# EAGLE design untitled (EAGLE 7.6.0)
TITLE: PSOC4 QFN
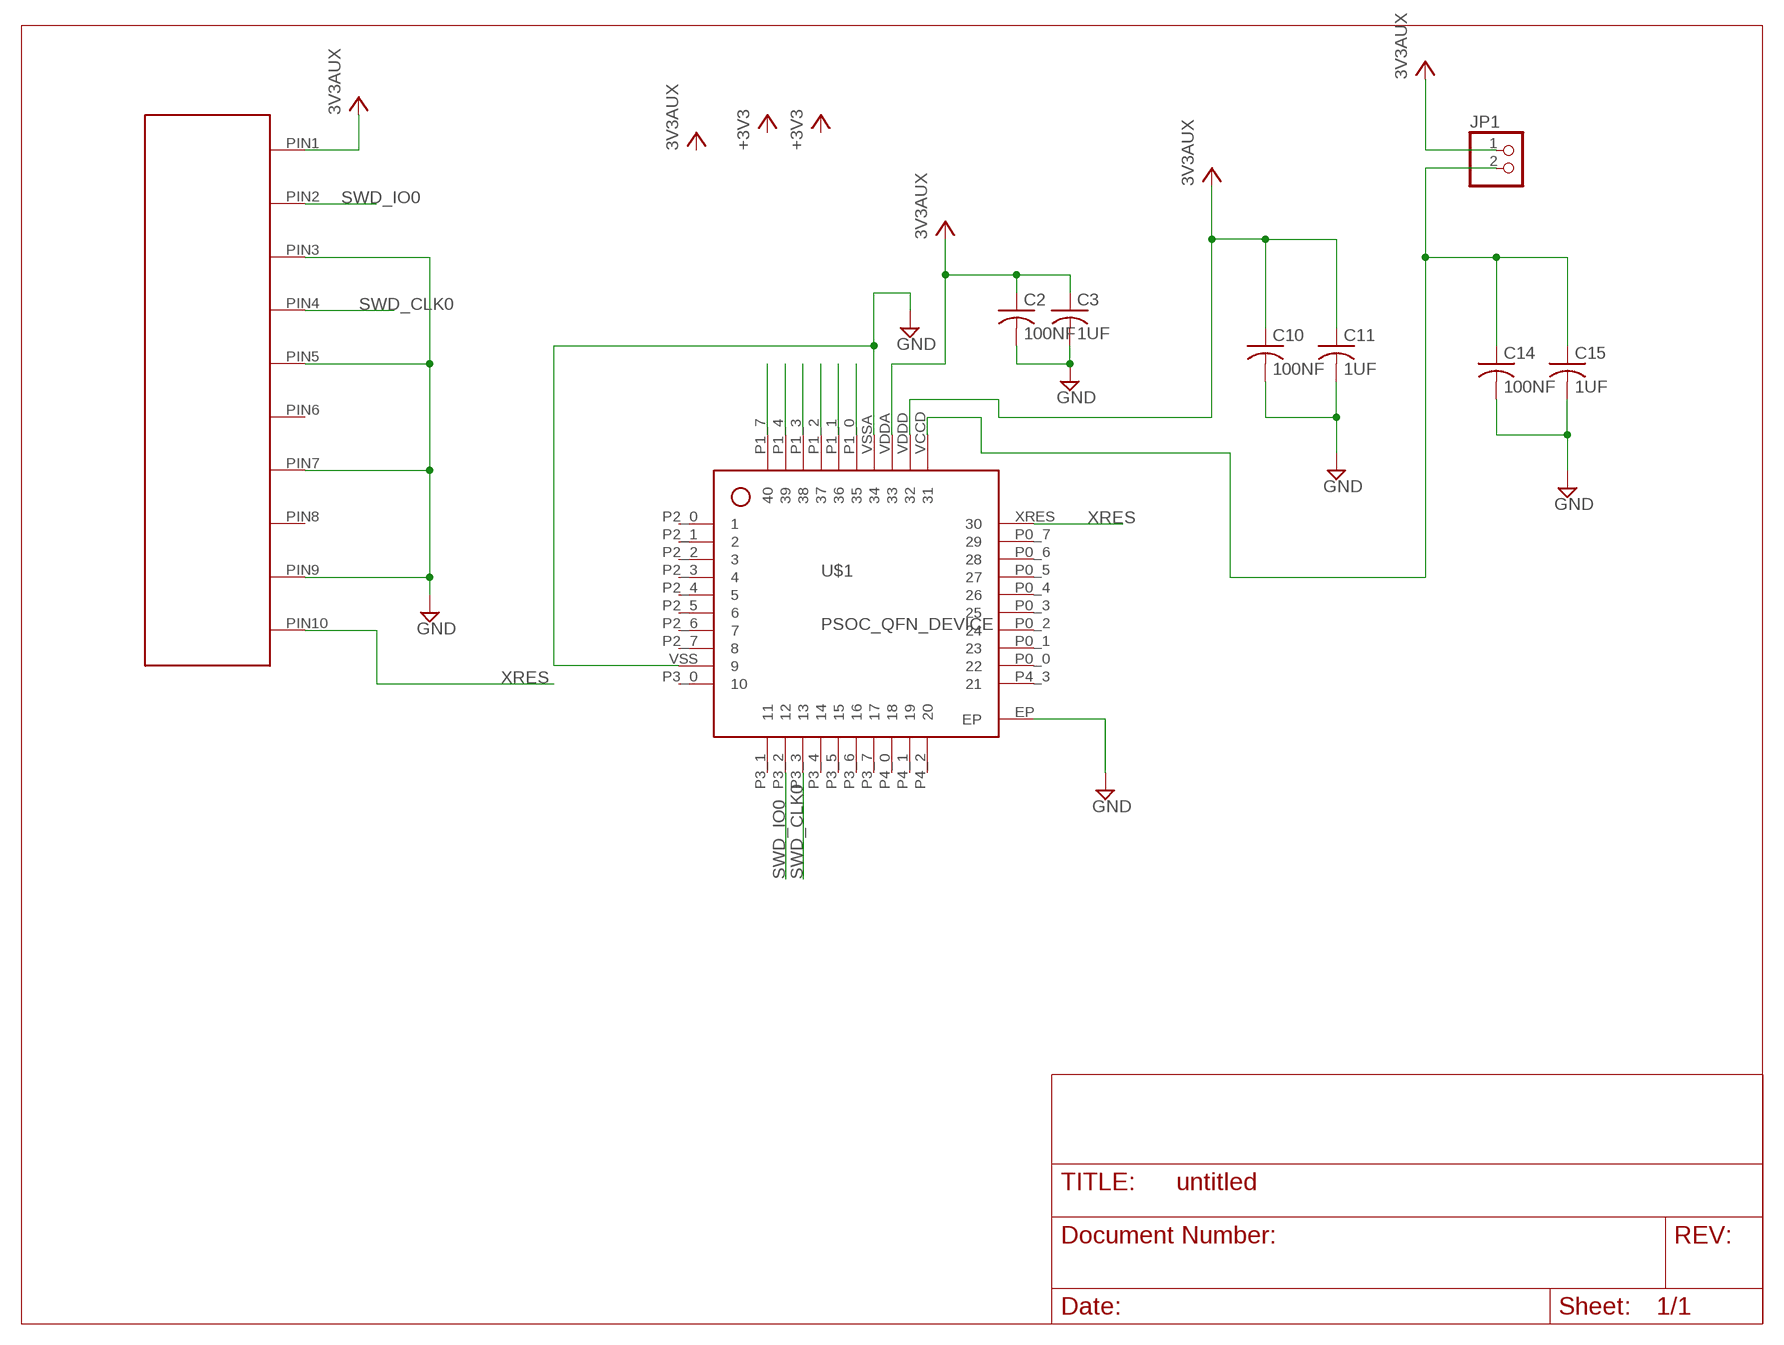
[diagram p0: schematic, sheet 1]
FRAME1 (LETTER_L): TITLE: PSOC

## Parts
C2  100NF  C-USC0603  [C0603]
C3  1UF  C-USC0603  [C0603]
C10  100NF  C-USC0603  [C0603]
C11  1UF  C-USC0603  [C0603]
C14  100NF  C-USC0603  [C0603]
C15  1UF  C-USC0603  [C0603]
JP1  PINHD-1X2/90  [1X02/90]
U$1  PSOC_QFN_DEVICE  [PSOC_QFN_PACKEGE]
U$2  PSOC_10_PIN_HEADER_DEVICE  [PSOC_10_PIN_HEADER]

## Nets
GND: C2.2 C3.2 C10.2 C11.2 C14.2 C15.2 U$1.EP U$1.VSS U$1.VSSA U$2.PIN3(GND) U$2.PIN5(GND) U$2.PIN7(GND) U$2.PIN9(GND)
N$1: U$1.P1_7
N$2: U$1.P1_4
N$3: U$1.P1_3
N$4: U$1.P1_2
N$5: U$1.P1_1
N$6: U$1.P1_0
SWD_CLK0: U$1.P3_3 U$2.PIN4(SWD_CLK0)
SWD_IO0: U$1.P3_2 U$2.PIN2(SWD_IO0)
VCC: C2.1 C3.1 C10.1 C11.1 JP1.1 U$1.VDDA U$1.VDDD U$2.PIN1(3V3_AUX) ; supply symbol labelled 3V3AUX
VCC2: C14.1 C15.1 JP1.2 U$1.VCCD
XRES: U$1.XRES U$2.PIN10(XRES)
Unconnected: U$1.P0_0 U$1.P0_1 U$1.P0_2 U$1.P0_3 U$1.P0_4 U$1.P0_5 U$1.P0_6 U$1.P0_7 U$1.P2_0 U$1.P2_1 U$1.P2_2 U$1.P2_3 U$1.P2_4 U$1.P2_5 U$1.P2_6 U$1.P2_7 U$1.P3_0 U$1.P3_1 U$1.P3_4 U$1.P3_5 U$1.P3_6 U$1.P3_7 U$1.P4_0 U$1.P4_1 U$1.P4_2 U$1.P4_3 U$2.PIN6(NC) U$2.PIN8(NC2)

## Library data of the parts
C2 C3 C10 C11 C14 C15 = rcl:C-US: CAPACITOR, American symbol
JP1 = pinhead:PINHD-1X2: PIN HEADER
U$1 = psoc_cy8c4245lqi-483:PSOC_QFN_DEVICE
U$2 = psoc_cy8c4245lqi-483:PSOC_10_PIN_HEADER_DEVICE

## Board
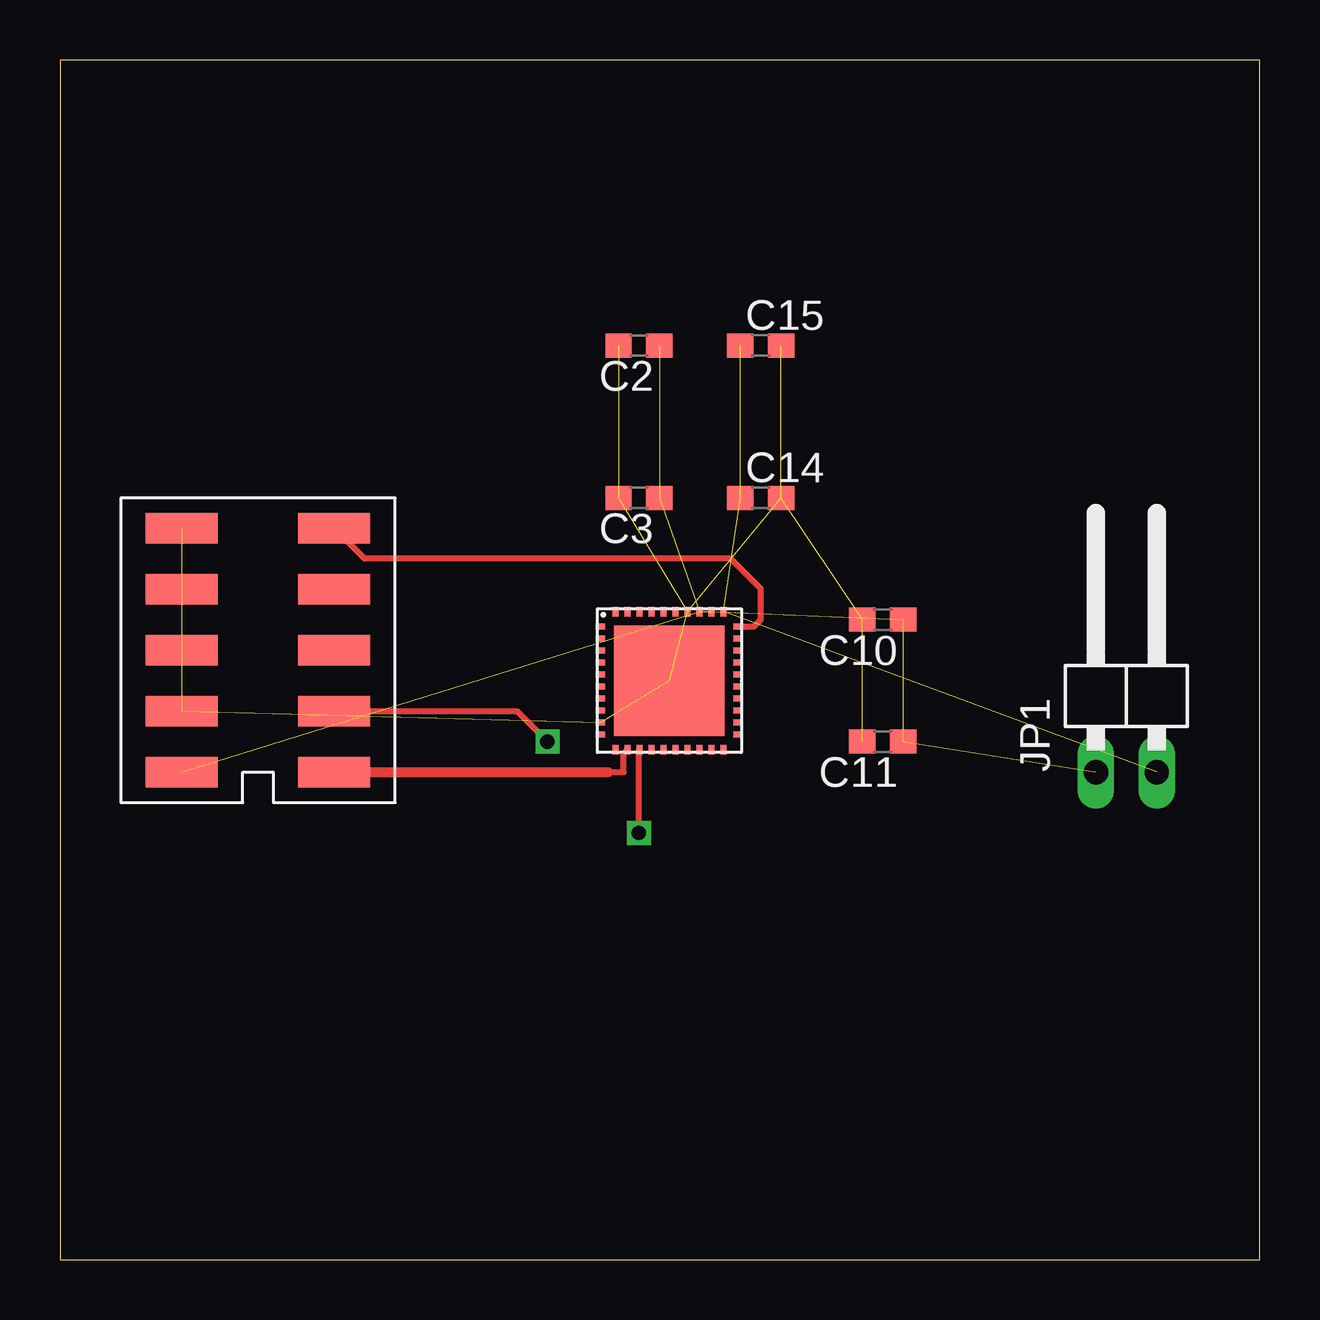
[diagram p1: board, top side]
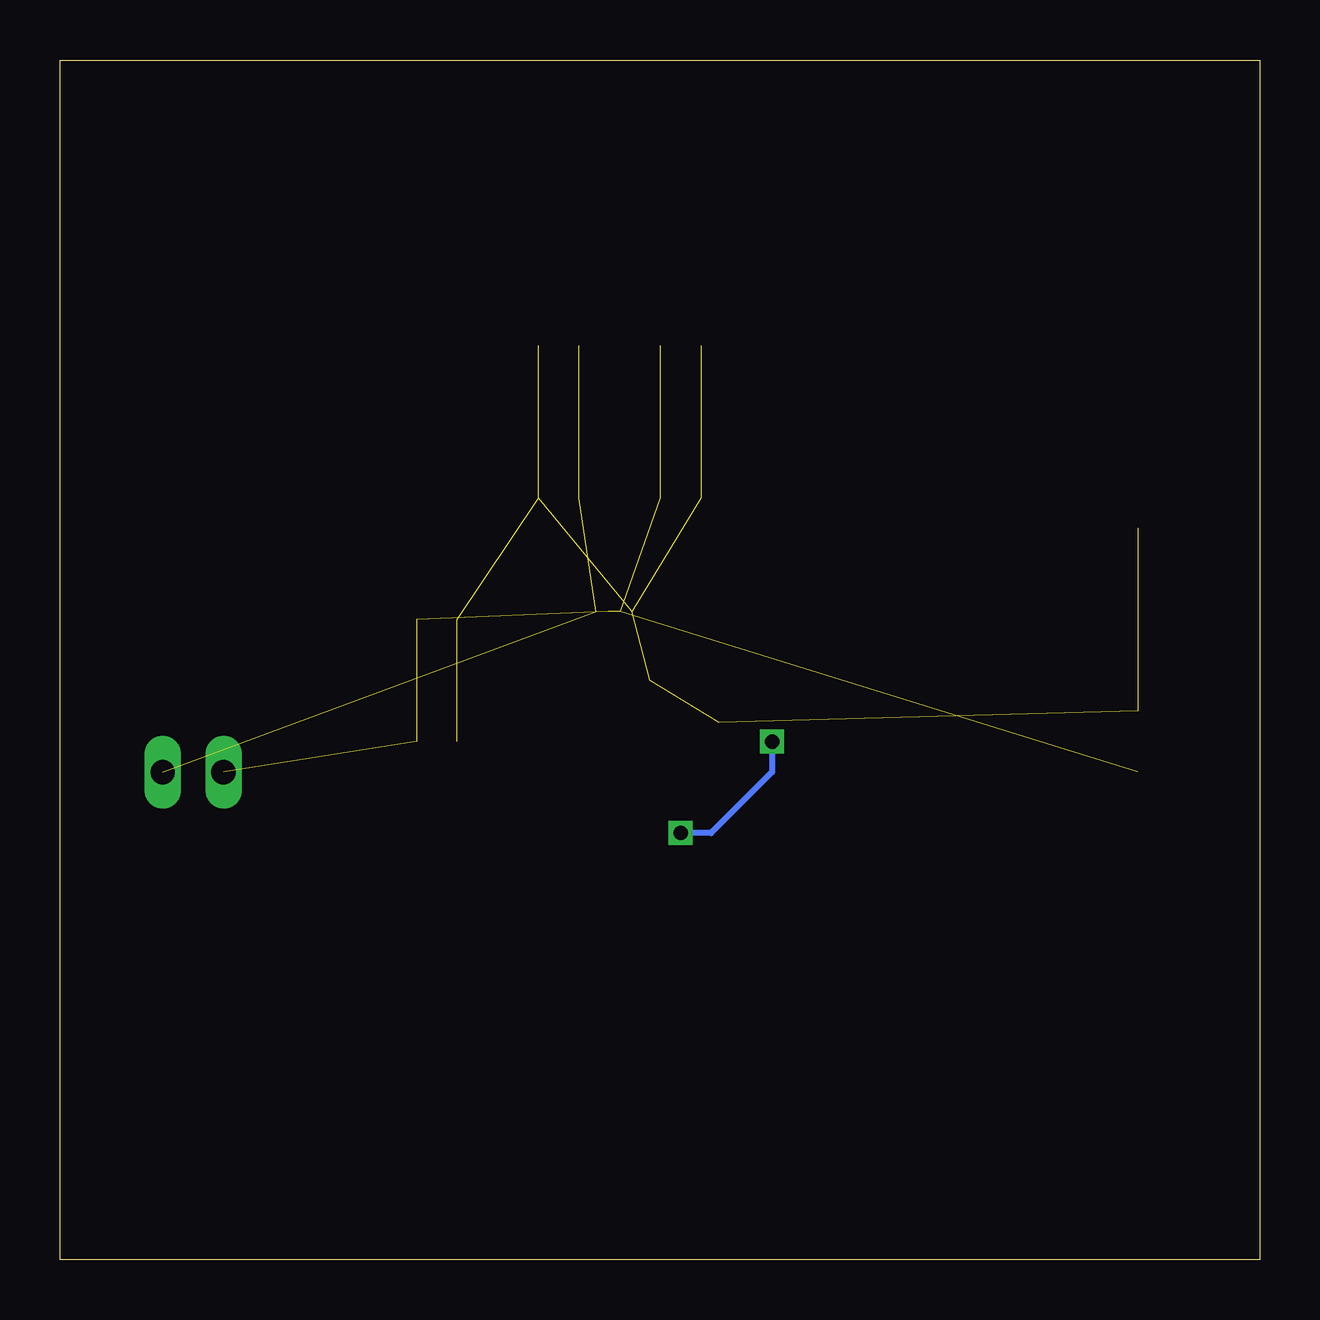
[diagram p2: board, bottom side, seen from below]

Size 50 x 50 mm. Coordinates in mm from the lower left corner, seen from the top.
Outline: 0,0 50,0 50,50 0,50 0,0
Copper layers (1*16): Top 0.035mm / dielectric 1.5mm / Bottom 0.035mm
Design rules "default": minimum track width 10mil, minimum drill 24mil, track to track 8mil, track to pad 8mil, pad to pad 8mil, via to via 8mil, smd to smd 8mil, copper to edge 40mil, drill to drill 8mil, minimum pad ring 10mil, minimum via ring 8mil, stop-mask expansion 4mil, vias tented up to drill 0mil, thermal gap 10mil

### Footprints (pad centres in the part's own frame; a part is rotated, then mirrored left to right if it is on the bottom)
C0603 = smd 1.1 x 1: 1 -0.85,0; 2 0.85,0
1X02/90 = drill 1.016 long: 1 -1.27,-3.81; 2 1.27,-3.81
PSOC_QFN_PACKEGE = smd 4.6 x 4.6: EP 0,0 | smd 0.4 x 0.25: P0_0 2.875,-1.75; P0_1 2.875,-1.25; P0_2 2.875,-0.75; P0_3 2.875,-0.25; P0_4 2.875,0.25; P0_5 2.875,0.75; P0_6 2.875,1.25; P0_7 2.875,1.75; P2_0 -2.875,2.25; P2_1 -2.875,1.75; P2_2 -2.875,1.25; P2_3 -2.875,0.75; P2_4 -2.875,0.25; P2_5 -2.875,-0.25; P2_6 -2.875,-0.75; P2_7 -2.875,-1.25; P3_0 -2.875,-2.25; P4_3 2.875,-2.25; VSS -2.875,-1.75; XRES 2.875,2.25 | smd 0.25 x 0.4: P1_0 0.25,2.875; P1_1 -0.25,2.875; P1_2 -0.75,2.875; P1_3 -1.25,2.875; P1_4 -1.75,2.875; P1_7 -2.25,2.875; P3_1 -2.25,-2.875; P3_2 -1.75,-2.875; P3_3 -1.25,-2.875; P3_4 -0.75,-2.875; P3_5 -0.25,-2.875; P3_6 0.25,-2.875; P3_7 0.75,-2.875; P4_0 1.25,-2.875; P4_1 1.75,-2.875; P4_2 2.25,-2.875; VCCD 2.25,2.875; VDDA 1.25,2.875; VDDD 1.75,2.875; VSSA 0.75,2.875
PSOC_10_PIN_HEADER = smd 1.27 x 3: PIN1 -5.08,3.81; PIN2 -5.08,-2.54; PIN3 -2.54,3.81; PIN4 -2.54,-2.54; PIN5 0,3.81; PIN6 0,-2.54; PIN7 2.54,3.81; PIN8 2.54,-2.54; PIN9 5.08,3.81; PIN10 5.08,-2.54

### Placement (x,y rotation side)
C2  24.13,38.1 180 top
C3  24.13,31.75 180 top
C10  34.29,26.67 180 top
C11  34.29,21.59 180 top
C14  29.21,31.75 0 top
C15  29.21,38.1 0 top
JP1  44.45,24.13 0 top
U$1  25.4,24.13 0 top
U$2  8.89,25.4 90 top

### Tracks (layer width: path | path; a pad name or v marks a point on that pad's centre or on a via)
GND  (12 unrouted)
SWD_CLK0  (via drill 0.6)
  Top 0.254: U$2.PIN4 19.05,22.86 v20.32,21.59 | v24.13,17.78 24.13,21.23 U$1.P3_3
  Bottom 0.254: v20.32,21.59 20.32,20.32 22.86,17.78 v24.13,17.78
SWD_IO0
  Top 0.254: 22.86,20.32 23.5,20.32 23.5,21.1 U$1.P3_2
  Top 0.406: U$2.PIN2 22.86,20.32
VCC  (7 unrouted)
VCC2  (3 unrouted)
XRES
  Top 0.254: U$1.XRES 28.92,26.38 29.21,26.67 29.21,27.94 27.94,29.21 12.7,29.21 U$2.PIN10